# Altium schematic sheet Power.SchDoc
size A2
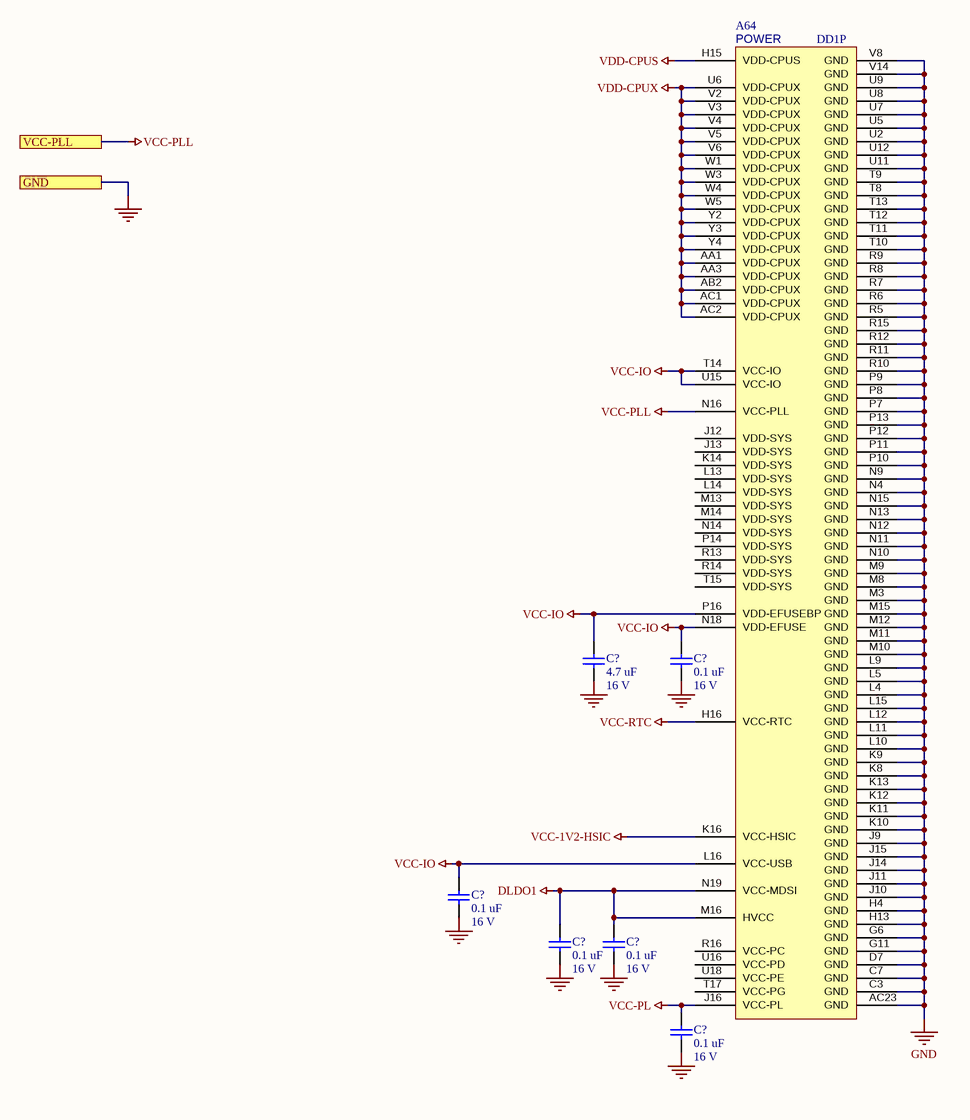
[diagram p0: Power.SchDoc]

## Parts
(Parts that share a designator on the sheet are numbered #1, #2 ... from top to bottom, then left to right.)
C?#1  4.7 uF  Voltage: 16 V  [CAPC1608X80N]
C?#2  0.1 uF  Voltage: 16 V  [CAPC1005X55N]
C?#3  0.1 uF  Voltage: 16 V  [CAPC1005X55N]
C?#4  0.1 uF  Voltage: 16 V  [CAPC1005X55N]
C?#5  0.1 uF  Voltage: 16 V  [CAPC1005X55N]
C?#6  0.1 uF  Voltage: 16 V  [CAPC1005X55N]
DD1  A64  [BGA396C65P23X23_1500X1500X130]  (part P of 16)

## Ports
GND, VCC-PLL

## Nets
DLDO1: C?#4.2 C?#5.2 DD1.M16(HVCC) DD1.N19(VCC-MDSI)
GND: C?#1.1 C?#2.1 C?#3.1 C?#4.1 C?#5.1 C?#6.1 DD1.AC23(GND) DD1.C3(GND) DD1.C7(GND) DD1.D7(GND) DD1.G6(GND) DD1.G11(GND) DD1.H4(GND) DD1.H13(GND) DD1.J9(GND) DD1.J10(GND) DD1.J11(GND) DD1.J14(GND) DD1.J15(GND) DD1.K8(GND) DD1.K9(GND) DD1.K10(GND) DD1.K11(GND) DD1.K12(GND) DD1.K13(GND) DD1.L4(GND) DD1.L5(GND) DD1.L9(GND) DD1.L10(GND) DD1.L11(GND) DD1.L12(GND) DD1.L15(GND) DD1.M3(GND) DD1.M8(GND) DD1.M9(GND) DD1.M10(GND) DD1.M11(GND) DD1.M12(GND) DD1.M15(GND) DD1.N4(GND) DD1.N9(GND) DD1.N10(GND) DD1.N11(GND) DD1.N12(GND) DD1.N13(GND) DD1.N15(GND) DD1.P7(GND) DD1.P8(GND) DD1.P9(GND) DD1.P10(GND) DD1.P11(GND) DD1.P12(GND) DD1.P13(GND) DD1.R5(GND) DD1.R6(GND) DD1.R7(GND) DD1.R8(GND) DD1.R9(GND) DD1.R10(GND) DD1.R11(GND) DD1.R12(GND) DD1.R15(GND) DD1.T8(GND) DD1.T9(GND) DD1.T10(GND) DD1.T11(GND) DD1.T12(GND) DD1.T13(GND) DD1.U2(GND) DD1.U5(GND) DD1.U7(GND) DD1.U8(GND) DD1.U9(GND) DD1.U11(GND) DD1.U12(GND) DD1.V8(GND) DD1.V14(GND) ; port GND
VCC-1V2-HSIC: DD1.K16(VCC-HSIC)
VCC-IO: C?#1.2 C?#2.2 C?#3.2 DD1.L16(VCC-USB) DD1.N18(VDD-EFUSE) DD1.P16(VDD-EFUSEBP) DD1.T14(VCC-IO) DD1.U15(VCC-IO)
VCC-PL: C?#6.2 DD1.J16(VCC-PL)
VCC-PLL: DD1.N16(VCC-PLL) ; port VCC-PLL
VCC-RTC: DD1.H16(VCC-RTC)
VDD-CPUS: DD1.H15(VDD-CPUS)
VDD-CPUX: DD1.AA1(VDD-CPUX) DD1.AA3(VDD-CPUX) DD1.AB2(VDD-CPUX) DD1.AC1(VDD-CPUX) DD1.AC2(VDD-CPUX) DD1.U6(VDD-CPUX) DD1.V2(VDD-CPUX) DD1.V3(VDD-CPUX) DD1.V4(VDD-CPUX) DD1.V5(VDD-CPUX) DD1.V6(VDD-CPUX) DD1.W1(VDD-CPUX) DD1.W3(VDD-CPUX) DD1.W4(VDD-CPUX) DD1.W5(VDD-CPUX) DD1.Y2(VDD-CPUX) DD1.Y3(VDD-CPUX) DD1.Y4(VDD-CPUX)

Not connected (* = marked no-connect by the designer): DD1 J12(VDD-SYS) J13(VDD-SYS) K14(VDD-SYS) L13(VDD-SYS) L14(VDD-SYS) M13(VDD-SYS) M14(VDD-SYS) N14(VDD-SYS) P14(VDD-SYS) R13(VDD-SYS) R14(VDD-SYS) R16(VCC-PC) T15(VDD-SYS) T17(VCC-PG) U16(VCC-PD) U18(VCC-PE)

## Notes on the sheet
- (in symbol A64, part P) POWER

## Library data of the parts
C?#1 = CAP-0044: CAP CER 4.7UF 16V X5R 0603; Manufacturer: Yageo; Manufacturer Part Number: CC0603KRX5R7BB475; Tolerance: ±10%; Type: Capacitors; Unique Id: CAP-0044; Author: Derstuganov; Case: 0603; Category: MLCC; ComponentLink1Description: Datasheet; ComponentLink1URL: https://www.yageo.com/upload/media/product/productsearch/datasheet/mlcc/UPY-GPHC_X5R_4V-to-50V_25.pdf; TC: X5R; Temperature: -55°C to 85°C; Termination style: SMD; Value: 4.7 uF; Status: Draft
C?#2-C?#6 = CAP-0035: CAP CER 0.1UF 16V X7R 0402; Manufacturer: Murata; Manufacturer Part Number: GCM155R71C104KA55J; Tolerance: ±10%; Type: Capacitors; Unique Id: CAP-0035; Author: Derstuganov; Case: 0402; Category: MLCC; ComponentLink1Description: Datasheet; ComponentLink1URL: https://search.murata.co.jp/Ceramy/image/img/A01X/G101/ENG/GRM155R71E104KE14-01.pdf; TC: X7R; Temperature: -55℃ to 125℃; Termination style: SMD; Value: 0.1 uF; Status: Draft
DD1 = A64: 4xA53